# Altium schematic sheet USB_OTG.SchDoc
size A4; SheetNumber: 14; SheetTotal: 14
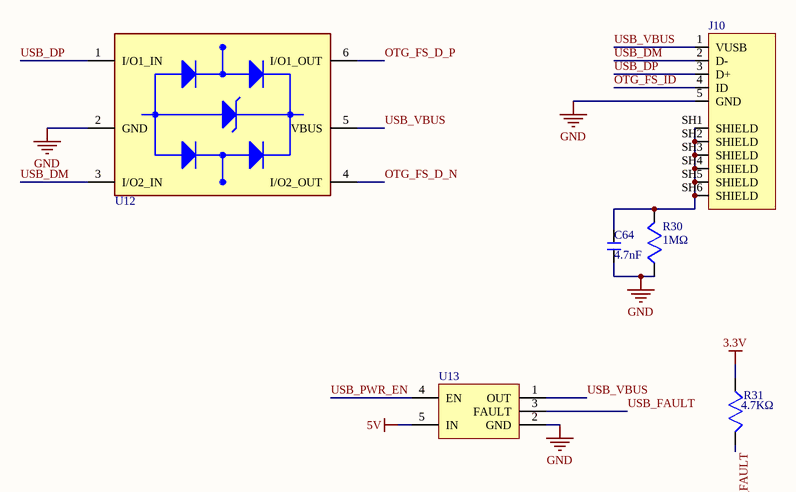
[diagram p0: USB_OTG.SchDoc]

## Parts
C64  value 4.7nF  [402 capacitor - duplicate]  (hidden comment: 0402 capacitor)
J10  10118192-0001LF  [10118192-0001LF]  (value not drawn)
R30  value 1MΩ  [402 RESISTOR]  (hidden comment: 0402. RESİSTOR)
R31  value 4.7KΩ  [805 resistor]  (hidden comment: 0805 resistor)
U12  USBLC6-2SC6  [USBLC6-2SC6]  (value not drawn)
U13  STMPS2141STR  [STMPS2141STR]  (value not drawn)

## Nets
3.3V: R31.1
5V: U13.5(IN)
GND: C64.2 J10.5(GND) R30.1 U12.2(GND) U13.2(GND)
OTG_FS_D_N: U12.4(I/O2_OUT)
OTG_FS_D_P: U12.6(I/O1_OUT)
OTG_FS_ID: J10.4(ID)
USB_DM: J10.2(D-) U12.3(I/O2_IN)
USB_DP: J10.3(D+) U12.1(I/O1_IN)
USB_FAULT: R31.2 U13.3(FAULT)
USB_PWR_EN: U13.4(EN)
USB_VBUS: J10.1(VUSB) U12.5(VBUS) U13.1(OUT)
NetC64_1: C64.1 J10.SH1(SHIELD) J10.SH2(SHIELD) J10.SH3(SHIELD) J10.SH4(SHIELD) J10.SH5(SHIELD) J10.SH6(SHIELD) R30.2

## Library data of the parts
C64 = CAP SMD 402: MPN: C0402C472K5RECAUTO; Package: 0402
J10 = 10118192-0001LF: CONN RCPT USB2.0 MICRO B SMD R/A; MPN: 10118192-0001LF
R30 = RES SMD 0402: MPN: CR0402JC1MS001; Package: 0402
R31 = RES SMD 0805: MPN: RG2012L-472-L-T05; Package: 0805
U12 = USBLC6-2SC6: TVS DIODE 5.25VWM 17VC SOT23-6; MPN: USBLC6-2SC6
U13 = STMPS2141STR: IC PWR SWITCH N-CHAN 1:1 SOT23-5; MPN: STMPS2141STR